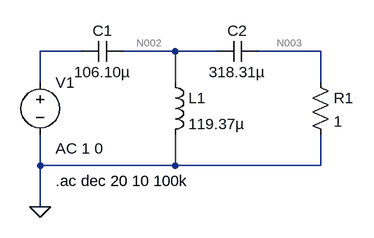
[diagram p0: schematic HPF_butter.asc]
HPF_butter.asc, the LTspice schematic file:
Version 4
SHEET 1 880 680
WIRE 192 256 128 256
WIRE 336 256 256 256
WIRE 400 256 336 256
WIRE 560 256 464 256
WIRE 128 304 128 256
WIRE 336 304 336 256
WIRE 560 304 560 256
WIRE 128 432 128 384
WIRE 336 432 336 384
WIRE 336 432 128 432
WIRE 560 432 560 384
WIRE 560 432 336 432
WIRE 128 496 128 432
FLAG 128 496 0
SYMBOL res 544 288 R0
SYMATTR InstName R1
SYMATTR Value 1
SYMBOL voltage 128 288 R0
WINDOW 123 24 118 Left 2
SYMATTR Value2 AC 1 0
SYMATTR InstName V1
SYMATTR Value ""
SYMBOL cap 256 240 R90
WINDOW 0 0 32 VBottom 2
WINDOW 3 32 32 VTop 2
SYMATTR InstName C1
SYMATTR Value 106.10µ
SYMBOL cap 464 240 R90
WINDOW 0 0 32 VBottom 2
WINDOW 3 32 32 VTop 2
SYMATTR InstName C2
SYMATTR Value 318.31µ
SYMBOL ind 320 288 R0
SYMATTR InstName L1
SYMATTR Value 119.37µ
TEXT 152 456 Left 2 !.ac dec 20 10 100k

The netlist it stands for:
* HPF_butter.asc
R1 N003 0 1
V1 N001 0 AC 1 0
C1 N002 N001 106.10µ
C2 N003 N002 318.31µ
L1 N002 0 119.37µ
.ac dec 20 10 100k
.backanno
.end

* Results of the author's LTspice run, read from the files saved beside the schematic
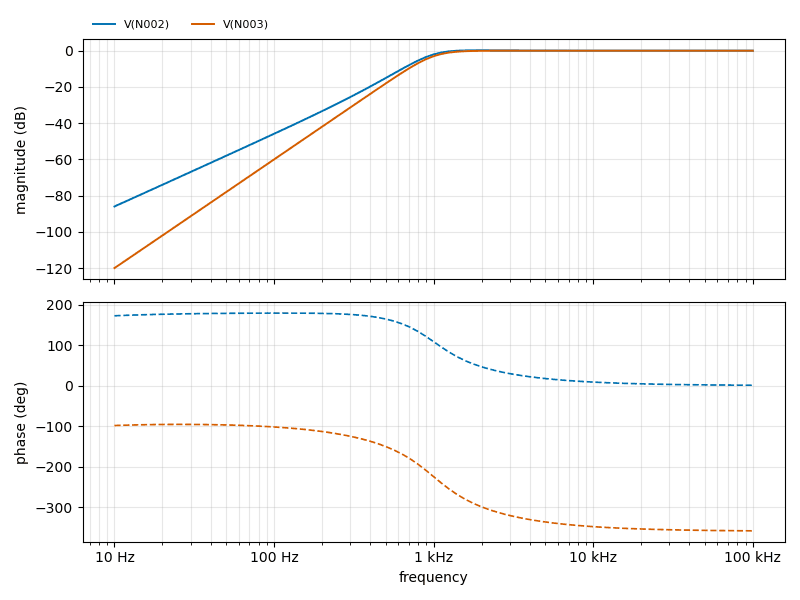
[diagram p1: AC Analysis of HPF_butter.asc, plotted from the saved traces]
* AC Analysis, 1 run:
*   V(N002): -85.94 dB at 10 Hz, 0.00 dB at 100 kHz, peak 0.19 dB at 1.995 kHz, 3 dB below the peak at 944.8 Hz
*   V(N003): -119.92 dB at 10 Hz, -0.00 dB at 100 kHz, peak -0.00 dB at 100 kHz, 3 dB below the peak at 1.002 kHz